# Altium schematic sheet BuckConverter_D14.SchDoc
size B; SheetNumber: 1; SheetTotal: 1
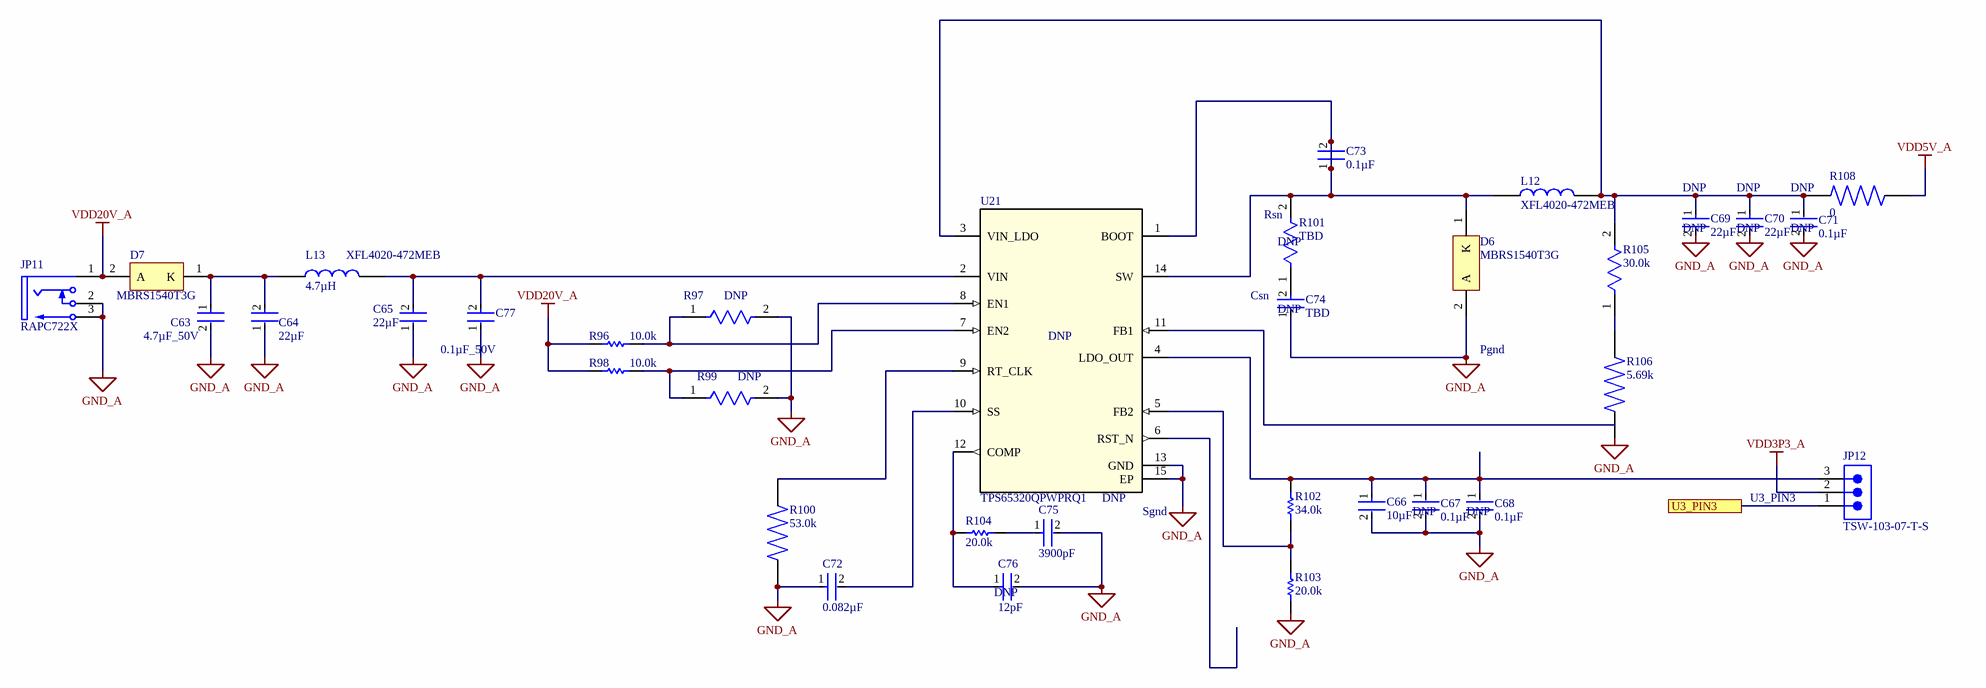
[diagram p0: BuckConverter_D14.SchDoc]

## Parts
C63  4.7µF_50V  [FP-C2012-125-0_2-MFG]
C64  22µF  [FP-GRM15-MFG]
C65  22µF  [FP-GRM15-MFG]
C66  10µF  [FP-C2012-125-0_2-MFG]
C67  0.1µF  [FP-GRM15-MFG]  (no BOM)
C68  0.1µF  [FP-GRM15-MFG]  (no BOM)
C69  22µF  [FP-C3216-160-0_2-IPC_B]  (no BOM)
C70  22µF  [FP-C3216-160-0_2-IPC_B]  (no BOM)
C71  0.1µF  [FP-GRM15-MFG]  (no BOM)
C72  0.082µF  [FP-C0402-BB-MFG]
C73  0.1µF  [FP-GRM15-MFG]
C74  TBD  [FP-GRM15-MFG]  (no BOM)
C75  3900pF  [FP-C0402-BB-MFG]
C76  12pF  [FP-C0402-BB-MFG]  (no BOM)
C77  0.1µF_50V  [FP-C1608-080-0_1-IPC_B]
D6  MBRS1540T3G  [ONSC-SMB-2-403A-03_E_V]
D7  MBRS1540T3G  [ONSC-SMB-2-403A-03_E_V]
JP11  RAPC722X  [SWITCH-RAPC712X-3_V]
JP12  TSW-103-07-T-S  [SMTC-TSW-103-07-X-S]
L12  XFL4020-472MEB  [XFL4020472MEB]
L13  4.7µH  [XFL4020472MEB]
R96  10.0k  [RESC1609X55X30LL15T15]
R97  DNP  [FP-ERJ-3GEY0R00V-MFG]  (no BOM)
R98  10.0k  [RESC1609X55X30LL15T15]
R99  DNP  [FP-ERJ-3GEY0R00V-MFG]  (no BOM)
R100  53.0k  [RESC1608X46N]
R101  TBD  [FP-CRCW0603-e3-MFG]  (no BOM)
R102  34.0k  [RESC1608X55X30ML15T15]
R103  20.0k  [RESC1608X55X30ML15T15]
R104  20.0k  [RESC1608X55X30ML15T15]
R105  30.0k  [FP-ERJ3EK-IPC_A]
R106  5.69k  [RESC1608X46N]
R108  0  [RESC6331X70N]
U21  TPS65320QPWPRQ1  [PWP0014E_N]  (no BOM)

## Ports
U3_PIN3

## Nets
GND_A: C63.2 C64.1 C65.1 C66.2 C67.2 C68.2 C69.2 C70.2 C71.2 C72.1 C74.1 C75.2 C76.2 C77.1 D6.2(A) JP11.2 JP11.3 R97.2 R99.2 R100.1 R103.1 R106.1 U21.13(GND) U21.15(EP)
VDD3P3_A: JP12.2
VDD5V_A: R108.2
VDD20V_A: D7.2(A) JP11.1 R96.1 R98.1
U3_PIN3: JP12.1 ; port U3_PIN3
NetC63_1: C63.1 C64.2 D7.1(K) L13.1
NetC65_2: C65.2 C77.2 L13.2 U21.2(VIN)
NetC66_1: C66.1 C67.1 C68.1 JP12.3 R102.2 U21.4(LDO_OUT)
NetC69_1: C69.1 C70.1 C71.1 L12.2 R105.2 R108.1 U21.3(VIN_LDO)
NetC72_2: C72.2 U21.10(SS)
NetC73_1: C73.1 C73.2 D6.1(K) L12.1 R101.2 U21.1(BOOT) U21.14(SW)
NetC74_2: C74.2 R101.1
NetC75_1: C75.1 R104.2
NetC76_1: C76.1 R104.1 U21.12(COMP)
NetR96_2: R96.2 R97.1 U21.8(EN1)
NetR98_2: R98.2 R99.1 U21.7(EN2)
NetR100_2: R100.2 U21.9(RT_CLK)
NetR102_1: R102.1 R103.2 U21.5(FB2)
NetR105_1: R105.1 R106.2

Not connected (* = marked no-connect by the designer): U21 6(RST_N) 11(FB1)

## Notes on the sheet
- (near R101) Rsn
- (near R101) DNP
- (near C69) DNP
- (near C70) DNP
- DNP
- (near C71) DNP
- (near L13) XFL4020-472MEB
- Csn
- (near C74) DNP
- (near U21) DNP
- Pgnd
- (near U21) Sgnd
- (near C67) DNP
- (near C68) DNP
- (near JP12) U3_PIN3
- (near C76) DNP

## Library data of the parts
C63 C66 = CMP-2000-05452-2: Multilayer Ceramic Capacitors 10μF ±10% 10V X7R SMD 0805; Capacitance: 10uF; Series: C; Case/Package: 0805; REACH SVHC: No SVHC; Tolerance: 10%; Resistor Type: Ceramic; Termination: SMD/SMT; Weight: 0.000194oz; Depth: 1.25mm; Construction: Flat; RoHS Compliant: Yes; Contact Plating: Tin; Packaging: Tape and Reel; Mount: Surface Mount; Thickness: 0.057inch; Radiation Hardening: No; Dielectric: X7R; Min Operating Temperature: -55°C; Voltage Rating (DC): 10V; Voltage: 10V; Width: 0.049inch; Package Quantity: 1; Number of Pins: 2; Height: 1.25mm; Max Operating Temperature: 125°C; Dielectric Material: Ceramic; Case Code (Imperial): 0805; Lead Free: Lead Free; Voltage Rating: 10V; Case Code (Metric): 2012; Length: 2mm
C64 C65 C67 C68 C71 C73 C74 = CMP-2100-03641-2: CAP CER 0.1UF 16V X7R 0402; Manufacturer Part Number: GRM155R71C104KA88D; Manufacturer: Murata; Standoff Height: 0mm; Tolerance: 10%; Description: CAP Ceramic 0.10μF 10% X7R 16Vdc 0402 SMD; Voltage Rating: 16Vdc; Material: Ceramic; Capacitance: 0.10μF; Value: 0.10μF; RoHS: TRUE; Temperature Characteristic: X7R; Octopart: https://octopart.com/grm155r71c104ka88d-murata-196880; Digikey Description: CAP CER 0.1UF 16V X7R 0402; Device Class L3: Ceramic Capacitors; Height: 0.55mm; ComponentLink2Description: Datasheet; Temperature Range Low: -55°C; Ipc Land Pattern Name: CAPC10050X219; ComponentLink2URL: https://search.murata.co.jp/Ceramy/image/img/A01X/G101/ENG/GRM155R71H471KA01-01A.pdf; Device Class L1: Passive Components; Lead Free: yes; Category: Cap; Package: GRM15; Temperature: -55°C to +125°C; Device Class L2: Capacitors; Temperature Range High: +125°C; Mouser Description: 0402 0.1 uF 16V ±10 % Tolerance X7R SMT Multilayer Ceramic Capacitor
C69 C70 = CMP-08246-004697-1: Multilayer Ceramic Capacitors 22uF ±20% 25V X5R SMD 1206; RoHS Compliant: Yes; Thickness: 0.071inch; Mount: Surface Mount; Termination: SMD/SMT; Height: 1.6mm; Resistor Type: Ceramic; REACH SVHC: No SVHC; Packaging: Tape and Reel; Construction: Flat; Depth: 1.6mm; Lead Free: Lead Free; Tolerance: 20%; Width: 0.063inch; Capacitance: 22uF; Weight: 0.000571oz; Case Code (Imperial): 1206; Case/Package: 1206; Min Operating Temperature: -55°C; Package Quantity: 1; Voltage Rating (DC): 25V; Length: 3.2mm; Voltage Rating: 25V; Case Code (Metric): 3216; Dielectric: X5R; Series: C; Dielectric Material: Ceramic; Max Operating Temperature: 85°C
C72 = CMP-1034-02057-3: Multilayer Ceramic Capacitor, C Series, 0.082 - F, - 10%, X7r, 16 V, 0402 [1005 Metric] Rohs Compliant: Yes; Manufacturer: Kemet; Manufacturer Part Number: C0402C823K4RACTU; Capacitance: 82,000 pF; Voltage Rating: 16 V; Description: C0402 82,000 pF X7R 10.00% 16 V; Temperature Coefficient: 15%; Value: 82,000 pF; Tolerance: 0.1; Device Class L2: Capacitors; ComponentLink2Description: Datasheet; Category: Cap; Temperature Range High: +125°C; Height: 0.55mm; Lead Free: Yes; Octopart: https://octopart.com/c0402c823k4ractu-kemet-134782; Device Class L3: Ceramic Capacitors; Ipc Land Pattern Name: CAPC10050X50; Package: C0402-BB; Temperature Range Low: -55°C; Temperature: -55°C to +125°C; Mouser Description: Multilayer Ceramic Capacitors MLCC - SMD/SMT 16volts 82000pF X7R 10%; Material: Ceramic; ComponentLink2URL: https://content.kemet.com/datasheets/KEM_C1002_X7R_SMD.pdf; Device Class L1: Passive Components; RoHS: TRUE; Automotive: No; Temperature Characteristic: X7R; Digikey Description: Multilayer Ceramic Capacitor, C Series, 0.082 - F, - 10%, X7r, 16 V, 0402 [1005 Metric] Rohs Compliant: Yes
C75 = CMP-1034-01791-3: CAP CER 3900PF 16V X7R 0402; Manufacturer Part Number: C0402C392K4RACTU; Manufacturer: Kemet; Value: 3,900 pF; Temperature Coefficient: 15%; Tolerance: 0.1; Material: Ceramic; Description: C0402 3,900 pF X7R 10.00% 16 V; Temperature Range High: +125°C; Automotive: No; Octopart: https://octopart.com/c0402c392k4ractu-kemet-12577363; RoHS: TRUE; Category: Cap; Temperature Range Low: -55°C; Device Class L1: Passive Components; Digikey Description: CAP CER 3900PF 16V X7R 0402; ComponentLink2Description: Datasheet; Voltage Rating: 16 V; Device Class L2: Capacitors; ComponentLink2URL: https://content.kemet.com/datasheets/KEM_C1002_X7R_SMD.pdf; Package: C0402-BB; Lead Free: Yes; Ipc Land Pattern Name: CAPC10050X50; Mouser Description: Multilayer Ceramic Capacitors MLCC - SMD/SMT 16volts 3900pF X7R 10%; Temperature Characteristic: X7R; Height: 0.55mm; Temperature: -55°C to +125°C; Device Class L3: Ceramic Capacitors; Capacitance: 3,900 pF
C76 = CMP-2008-03330-2: CAP CER 12PF 25V C0G/NP0 0402; Manufacturer Part Number: C0402C120J3GACAUTO; Manufacturer: Kemet; Material: Ceramic; Temperature Characteristic: C0G; Temperature Coefficient: 15%; Tolerance: 0.05; Description: C0402 12 pF C0G 5.00% 25 V; Temperature Range High: +125°C; ComponentLink2URL: https://content.kemet.com/datasheets/KEM_C1002_X7R_SMD.pdf; Lead Free: Yes; Device Class L2: Capacitors; Voltage Rating: 25 V; Device Class L1: Passive Components; Temperature Range Low: -55°C; Value: 12 pF; Automotive: No; Category: Cap; Height: 0.55mm; Octopart: https://octopart.com/c0402c120j3gacauto-kemet-21768529; Digikey Description: CAP CER 12PF 25V C0G/NP0 0402; Temperature: -55°C to +125°C; Device Class L3: Ceramic Capacitors; Package: C0402-BB; Capacitance: 12 pF; ComponentLink2Description: Datasheet; Ipc Land Pattern Name: CAPC10050X50; RoHS: TRUE
C77 = CMP-2000-04982-2: Multilayer Ceramic Capacitors 100nF ±10% 50V X7R SMD 0603; REACH SVHC: No SVHC; Voltage: 50V; Min Operating Temperature: -55°C; Package Quantity: 1; Case Code (Metric): 1608; Series: C; Termination: SMD/SMT; Length: 1.6mm; Voltage Rating: 50V; Case Code (Imperial): 0603; Number of Pins: 2; RoHS Compliant: Yes; Thickness: 0.037inch; Resistor Type: Ceramic; Radiation Hardening: No; Weight: 7.1E-05oz; Mount: Surface Mount; Capacitance: 100nF; Voltage Rating (DC): 50V; Construction: Flat; Tolerance: 10%; Lead Free: Lead Free; Case/Package: 0603; Max Operating Temperature: 125°C; Height: 0.8mm; Depth: 0.8mm; Packaging: Tape and Reel; Width: 0.031inch; Dielectric Material: Ceramic; Dielectric: X7R
D6 D7 = CMP-1055-00338-1: Schottky Power Rectifier, 2-Pin SMB, Pb-Free, Tape and Reel; Manufacturer: On Semiconductor; IFSM Max (A): 40; Configuration: Single; PackageReference: SMB-2-403A-03_E; PackageDescription: 2-Pin Small Molded Package, J-Bend Lead, Body 4.315 x 3.555 mm; ComponentLink1URL: http://www.onsemi.com/; Packing: Tape and Reel; PartNumber: MBRS1540T3G; ComponentLink1Description: Manufacturer URL; ComponentLink3URL: http://www.onsemi.cn/pub_link/Collateral/MBRS1540T3-D.PDF; RoHS: TRUE; PackageVersion: Rev. E, 08/2005; ComponentLink2Description: Datasheet; DatasheetVersion: Rev. 3; Mounting Technology: Surface Mount; ComponentLink3Description: Package Specification; ComponentLink2URL: http://www.onsemi.cn/pub_link/Collateral/MBRS1540T3-D.PDF
JP11 = CMP-2000-05384-1: Power Jack, 5 A, 3-Pin THD, RoHS, Bulk; Manufacturer: Switchcraft; Current Rating: 5A; Plug/Mating Plug Diameter: 2.1mmID,5.5mmOD; Gender: Male; Mating Products: S765-ND / -CONNPLUGMINIPWR2CONDWHT/RED / S760K-ND / -CONNPOWERPLUGMINI.08"BLACK / SC1052-ND / -CONNPOWERPLUGMINIBLACK; Number of Positions/Contacts: 2Conductors,2Contacts; Internal Switch(s): SingleSwitch,NormallyClosed; Shielding: Unshielded; Catalog Drawings: RAPC7(1,2)2XSide / RAPC7(1,2)2XTop; Dynamic Catalog: SwitchcraftInc; Other Names: Q2287470A / RAPC722X-ND / SC1313; Standard Package: 2,500; Termination: SolderEyelet(s); Family: Barrel-PowerConnectors; Housing Color: Black; Housing Material: Thermoplastic; RoHS Information: SwitchcraftRoHSInfo; Color: Black; Contact Material - Plating: Nickel; Mounting Type: ThroughHole,RightAngle; Manufacturer URL: http://www.switchcraft.com/; Contact Material: Brass; Datasheet Version: Rev. A, 08/2005; Connector Type: Jack; Category: Connectors,Interconnects; Datasheet URL: http://www.mouser.com/ds/2/393/rapc722x_cd-371352.pdf
JP12 = CMP-1024-00332-1: 0.025" SQ Post Header, Through-hole, Vertical, -55 to 105 degC, 2.54 mm Pitch, 3-Pin, Male, RoHS; Manufacturer: Samtec; Pitch: 2.54 mm; ComponentLink1URL: http://www.samtec.com; ComponentLink3URL: http://www.samtec.com/documents/webfiles/cpdf/TSW-XXX-XX-XXX-X-XX-XXX-MKT.pdf; PartNumber: TSW-103-07-T-S; Mounting Technology: Through-hole; RoHS: True; DatasheetVersion: F-214; PackageVersion: DM, 8/1988; Temperature Range: -55 to 105 degC; ComponentLink2Description: Datasheet; ComponentLink1Description: Manufacturer URL; Orientation: Vertical; PackageReference: TSW-103-07-X-S; ComponentLink3Description: Package Specification; ComponentLink2URL: http://www.samtec.com/documents/webfiles/pdf/TSW_TH.PDF; PackageDescription: .025[0.64] SQ. Post Terminal Strip Assembly
L12 L13 = XFL4020-472MEB: Fixed Inductors 4.7uH 20% 5A 57.4mOhms AEC-Q200; Manufacturer_Name: COILCRAFT; Geometry.Height: 2.1mm; Manufacturer_Part_Number: XFL4020-472MEB; Mouser Part Number: 994-XFL4020-472MEB; Mouser Price/Stock: https://www.mouser.co.uk/ProductDetail/Coilcraft/XFL4020-472MEB?qs=VJjuEbE9QBPFBMgGchYEoQ%3D%3D; Arrow Part Number: *; Arrow Price/Stock: *; Datasheet Link: https://componentsearchengine.com/Datasheets/1/XFL4020-472MEB.pdf
R96 R98 = CMP-1012-00623-3: Chip Resistor, 10 KOhm, +/- 1%, 0.1 W, -55 to 155 degC, 0603 (1608 Metric), RoHS, Tape and Reel; Manufacturer: Panasonic; Voltage Rating: 75V; Case\/Package: 0603; Power Rating: 100mW; Resistance: 10KOhm; Temperature Coefficient: 100ppm\/degreesC; Number of Pins: 2; Package Reference: 603; Depth: 0.8mm; Mount: SurfaceMount; Package Description: 2-Pin Surface Mount Device, Body 1.6 x 0.85 mm; Datasheet Version: 02/2017; Length: 1.6mm; Lead Free: LeadFree; Height: 0.45mm; Number of Terminations: 2; Max Power Dissipation: 100mW; Min Operating Temperature: -55degC; Datasheet URL: https://industrial.panasonic.com/cdbs/www-data/pdf/RDA0000/AOA0000C304.pdf; Termination: SMD/SMT; Case Code (Metric): 1608; Case Code (Imperial): 0603; Tolerance: 1%; Max Operating Temperature: 155degC; RoHSCompliant: true; Voltage Rating (DC): 75V; Radiation Hardening: No; Packaging: TapeandReel; Composition: ThickFilm; Mounting Technology: SurfaceMount; Manufacturer URL: http://www.panasonic.com/; Width: 0.031inch; REACH SVHC: NoSVHC; Contact Plating: Tin; Military Standard: Not; Package Quantity: 1
R97 R99 = CMP-2000-00700-2: RES SMD 0 OHM JUMPER 1/10W 0603; Manufacturer Part Number: ERJ-3GEY0R00V; Manufacturer: Panasonic; Tolerance: 5%; Description: 0 Ohms Jumper 0.1W, 1/10W Chip Resistor 0603 (1608 Metric) Automotive AEC-Q200 Thick Film; Automotive Grade: Grade 0; Voltage Rating: 75V; Value: 0Ω; Temperature Coefficient: -100/+600ppm/°C; Power Rating: 0.1W; Mouser Description: Resistor, Chip Thick Film, 0 Ohm, 0.1w, Resistor, Chip Thick Film, 0 Ohm, 0.1w, 5%; Ipc Land Pattern Name: RESC16080X45; Category: Res; Package: 0603; Temperature: -55°C to +155°C; Temperature Range Low: -55°C; Series: ERJ; Resistance: 0Ω; RoHS: TRUE; Composition: Thick Film; Octopart: https://octopart.com/erj-3gey0r00v-panasonic-55389238; Device Class L1: Passive Components; Footprint Url: https://industrial.panasonic.com/cdbs/www-data/pdf/RDA0000/DMA0000COL17.pdf; ComponentLink2Description: Datasheet; Device Class L2: Resistors; Temperature Range High: +155°C; Digikey Description: RES SMD 0 OHM JUMPER 1/10W 0603; Lead Free: Yes; Device Class L3: Chip SMD Resistors; Height: 0.55mm; ComponentLink2URL: https://industrial.panasonic.com/cdbs/www-data/pdf/RDA0000/AOA0000C301.pdf; Automotive: Yes
R100 = PAT0603E5302BST1: Package: None; Price: None; Value: *; MP: PAT0603E5302BST1; Availability: Unavailable
R101 = CMP-1666-00003-5: RES Thick Film, 1kΩ, 1%, 0.1W, 100ppm/°C, 0603; Max Power Dissipation: 100mW; Voltage Rating: 75V; Resistance: 1kR; Max Operating Temperature: 155°C; Number of Pins: 2; Case Code (Imperial): 0603; Width: 0.033inch; Power Rating: 100mW; Number of Terminations: 2; Package Quantity: 10; Weight: 7.1E-05oz; Tolerance: 1%; Temperature Coefficient: 100ppm/°C; Military Standard: Not; Mount: Surface Mount; Voltage Rating (DC): 75V; Depth: 0.85mm; Composition: Thick Film; Radiation Hardening: No; Termination: SMD/SMT; Length: 1.55mm; Case Code (Metric): 1608; Contact Plating: Tin; Min Operating Temperature: -55°C; Packaging: Tape and Reel; Height: 0.45mm; Lead Free: Lead Free; Case/Package: 0603; Features: Automotive AEC-Q200
R102 = CMP-2000-00447-1: Part Number: ERJ-3EKF3402V; Manufacturer: Panasonic
R103 R104 = CMP-2000-00318-1: Part Number: ERJ-3EKF2002V; Manufacturer: Panasonic
R105 = CMP-2000-00413-2: RES SMD 30K OHM 1% 1/10W 0603; Voltage Rating: 75V; Temperature Coefficient: 100ppm/°C; Max Power Dissipation: 100mW; Resistance: 30kR; Case Code (Imperial): 0603; Termination: SMD/SMT; Number of Terminations: 2; Series: ERJ; Features: Automotive AEC-Q200; Width: 0.031inch; Packaging: Tape and Reel; REACH SVHC: No SVHC; Lead Free: Lead Free; RoHS Compliant: Yes; Contact Plating: Tin; Case/Package: 0603; Tolerance: 1%; Mount: Surface Mount; Min Operating Temperature: -55°C; Resistor Type: Thick Film; Radiation Hardening: No; Resistance Tolerance: 1%; Construction: Rectangular; Power Rating: 100mW; Case Code (Metric): 1608; Size Code: 0603; Voltage Rating (DC): 75V; Military Standard: Not; Package Quantity: 1; Depth: 0.8mm; Length: 1.6mm; Height: 0.022inch; Max Operating Temperature: 155°C
R106 = PAT0603E5691BST1: Package: None; Price: None; Value: *; MP: PAT0603E5691BST1; Availability: Unavailable
R108 = CRCW25120000Z0EGHP: 0 Ohms Jumper 1.5W Chip Resistor 2512 (6432 Metric) Automotive AEC-Q200, Pulse Withstanding Thick Film; MF: Vishay Dale; SnapEDA_Link: https://www.snapeda.com/parts/CRCW25120000Z0EGHP/Vishay+Dale/view-part/?ref=snap; Package: 6331 Vishay; Value: *; MP: CRCW25120000Z0EGHP; Check_prices: https://www.snapeda.com/parts/CRCW25120000Z0EGHP/Vishay+Dale/view-part/?ref=eda
U21 = TPS65320QPWPRQ1: Automotive 3.6V to 36V, 3.2A Buck Converter with Auto-Sourced 280mA LDO Regulator 14-HTSSOP -40 to 125; Manufacturer_Name: Texas Instruments; CompType: IC; TYPE: TYPE; RefDes: RefDes; Copyright: Copyright (C) 2025 Ultra Librarian. All rights reserved.; Manufacturer_Part_Number: TPS65320QPWPRQ1; Datasheet: https://www.ti.com/lit/gpn/tps65320-q1; PartNumber: TPS65320QPWPRQ1; PackageReference: PWP0014E; MountType: SMT; RoHS: Y; Manufacturer: Texas Instruments